# Altium project nrf52_linkit.PrjPcb
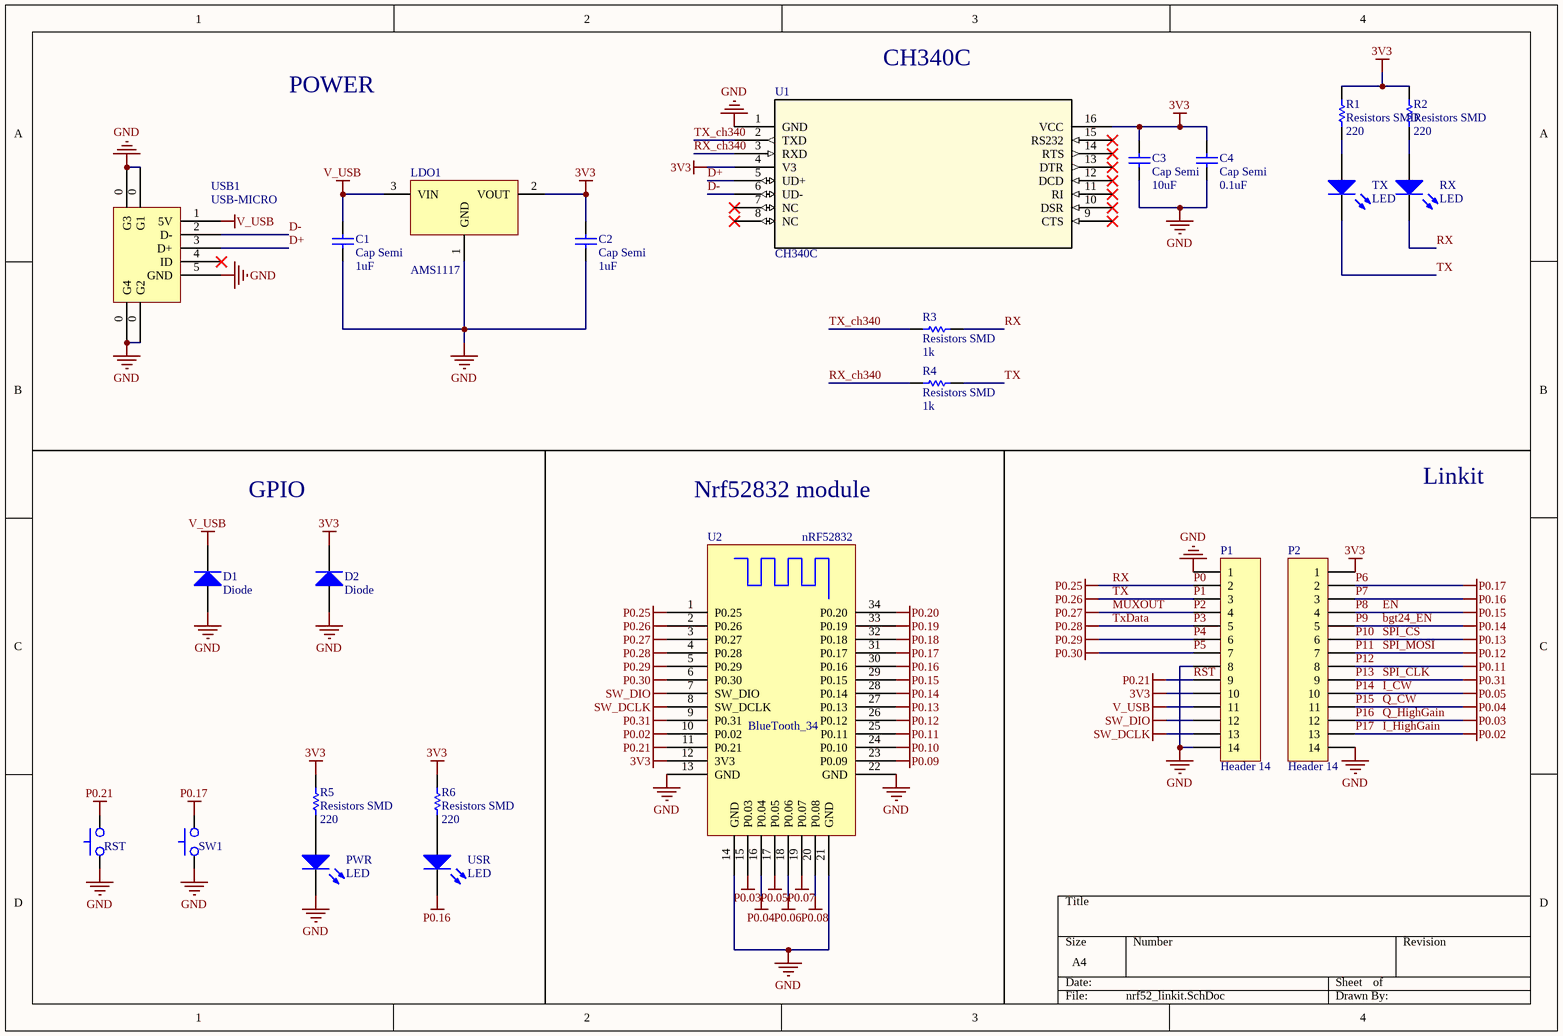
[diagram p0: nrf52_linkit.SchDoc]
1 sheet, 24 parts. Net scope: global (net labels, ports and power ports of the same name join across sheets).
Board files: nRF52832_extend.PcbDoc, nrf52_linkit.PcbDoc, nrf52_Radar.PcbDoc

## Sheet nrf52_linkit.SchDoc
size A4

### Parts
C1  Cap Semi  value 1uF  [C0603]
C2  Cap Semi  value 1uF  [C0603]
C3  Cap Semi  value 10uF  [C0603]
C4  Cap Semi  value 0.1uF  [C0603]
D1  Diode  [6-0805_M]
D2  Diode  [6-0805_M]
LDO1  AMS1117  [SOT-223]
P1  Header 14  [HDR1X14]
P2  Header 14  [HDR1X14]
PWR  LED  [0603]
R1  Resistors SMD  value 220  [R0603-M]
R2  Resistors SMD  value 220  [R0603-M]
R3  Resistors SMD  value 1k  [R0603-M]
R4  Resistors SMD  value 1k  [R0603-M]
R5  Resistors SMD  value 220  [R0603-M]
R6  Resistors SMD  value 220  [R0603-M]
RST  SW-PB  [SWITCH_SMD_4x3_DHT-1185]  (value not drawn)
RX  LED  [0603]
SW1  SW-PB  [SWITCH_SMD_4x3_DHT-1185]  (value not drawn)
TX  LED  [0603]
U1  CH340C  [SOP16-M]
U2  nRF52832  [BlueTooth_34_SMD]
USB1  USB-MICRO  [USB-MICRO]
USR  LED  [0603]

### Nets
3V3: C2.2 C3.2 C4.2 D2.2(K) LDO1.2(VOUT) P1.10 P2.1 R1.2 R2.2 R5.2 R6.2 U1.4(V3) U1.16(VCC) U2.12(3V3)
bgt24_EN: P2.5 U2.28(P0.14)  [also labelled P0.14, P9]
EN: P2.4 U2.29(P0.15)  [also labelled P0.15, P8]
GND: C1.1 C2.1 C3.1 C4.1 D1.1(A) D2.1(A) LDO1.1(GND) P1.1 P1.8 P1.14 P2.14 PWR.2(K) RST.2 SW1.2 U1.1(GND) U2.13(GND) U2.14(GND) U2.21(GND) U2.22(GND) USB1.0(G1) USB1.5(GND)
I_CW: P2.10 U2.17(P0.05)  [also labelled P0.05, P14]
I_HighGain: P2.13 U2.10(P0.02)  [also labelled P0.02, P17]
MUXOUT: P1.4 U2.3(P0.27)  [also labelled P0.27, P2]
P0: P1.2 R3.1 RX.2(K) U2.1(P0.25)  [also labelled P0.25, RX]
P0.06: U2.18(P0.06)
P0.07: U2.19(P0.07)
P0.08: U2.20(P0.08)
P0.09: U2.23(P0.09)
P0.10: U2.24(P0.10)
P0.18: U2.32(P0.18)
P0.19: U2.33(P0.19)
P0.20: U2.34(P0.20)
P1: P1.3 R4.1 TX.2(K) U2.2(P0.26)  [also labelled P0.26, TX]
P3: P1.5 U2.4(P0.28)  [also labelled P0.28, TxData]
P4: P1.6 U2.5(P0.29)  [also labelled P0.29]
P5: P1.7 U2.6(P0.30)  [also labelled P0.30]
P6: P2.2 SW1.1 U2.31(P0.17)  [also labelled P0.17]
P7: P2.3 U2.30(P0.16) USR.2(K)  [also labelled P0.16]
P10: P2.6 U2.27(P0.13)  [also labelled P0.13, SPI_CS]
P11: P2.7 U2.26(P0.12)  [also labelled P0.12, SPI_MOSI]
P12: P2.8 U2.25(P0.11)  [also labelled P0.11]
P13: P2.9 U2.9(P0.31)  [also labelled P0.31, SPI_CLK]
P15: P2.11 U2.16(P0.04)  [also labelled P0.04, Q_CW]
P16: P2.12 U2.15(P0.03)  [also labelled P0.03, Q_HighGain]
RST: P1.9 RST.1 U2.11(P0.21)  [also labelled P0.21]
SW_DCLK: P1.13 U2.8(SW_DCLK)
SW_DIO: P1.12 U2.7(SW_DIO)
V_USB: C1.2 D1.2(K) LDO1.3(VIN) P1.11 USB1.1(5V)
D+: U1.5(UD+) USB1.3(D+)
D-: U1.6(UD-) USB1.2(D-)
RX_ch340: R4.2 U1.3(RXD)
TX_ch340: R3.2 U1.2(TXD)
NetPWR_1: PWR.1(A) R5.1
NetR1_1: R1.1 TX.1(A)
NetR2_1: R2.1 RX.1(A)
NetR6_1: R6.1 USR.1(A)

Not connected (* = marked no-connect by the designer): U1 7(NC)* 8(NC)* 9(CTS)* 10(DSR)* 11(RI)* 12(DCD)* 13(DTR)* 14(RTS)* 15(RS232)*; USB1 4(ID)*

### Notes on the sheet
- POWER
- CH340C
- GPIO
- Nrf52832 module
- Linkit
- (in symbol nRF52832) BlueTooth_34

### Library data of the parts
C1-C4 = Cap Semi: Capacitor (Semiconductor SIM Model); Published: 8-Jun-2000; LatestRevisionDate: 29-May-2009; LatestRevisionNote: IPC-7351 Footprint Added.; PackageReference: C1206; Publisher: Altium Limited; PackageDescription: Chip Capacitor
D1 D2 = Diode: Default Diode; Published: 8-Jun-2000; LatestRevisionDate: 17-Jul-2002; LatestRevisionNote: Re-released for DXP Platform.; PackageVersion: Sep-1996; PackageReference: SMC; Publisher: Altium Limited; PackageDescription: DO-214-AB/SMC; 2 C-Bend Leads; Body 7.9 x 5.9 mm, inc. leads (LxW); Code_JEDEC: DO-214-AB
P1 P2 = Header 14: Header, 14-Pin; LatestRevisionDate: 17-Jul-2002; LatestRevisionNote: Re-released for DXP Platform.; Publisher: Altium Limited
PWR RX TX USR = LED: Typical INFRARED GaAs LED; Published: 8-Jun-2000; LatestRevisionDate: 08-Jul-2005; LatestRevisionNote: Mech Layer 1 removed.; PackageReference: LED-0; Publisher: Altium Limited; PackageDescription: LED; 2 Leads
R1-R6 = Resistors SMD: Resistor
RST SW1 = SW-PB: 按鈕開關; Published: 24-Mar-1999; LatestRevisionDate: 17-Jul-2002; LatestRevisionNote: Re-released for DXP Platform.; PackageReference: SPST-2; Publisher: Altium Limited
U1 = CH340C: No Description Available; Built_By: EMA_UL_Team; RefDes: RefDes; Type: DEV; Value: Value